# EAGLE design control (EAGLE 9.6.2)
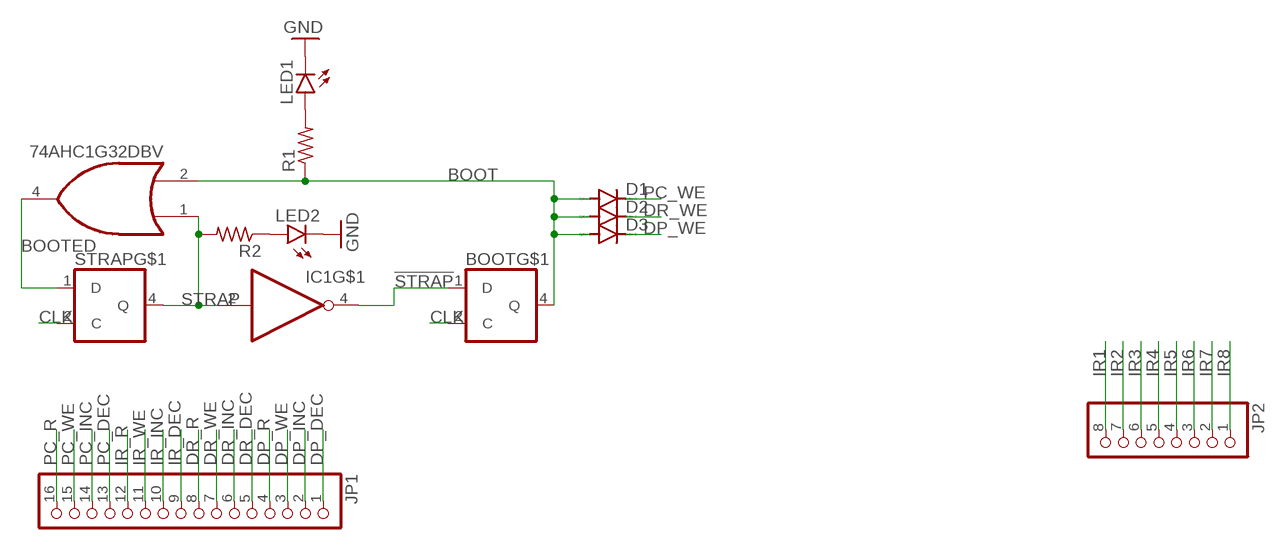
[diagram p0: schematic, sheet 1]

## Parts
BOOT  74LVC1G79DBV  [SOT23-5]
D1  DIODE-SOD323-W  [SOD323-W]
D2  DIODE-SOD323-W  [SOD323-W]
D3  DIODE-SOD323-W  [SOD323-W]
IC1  74AUC1G06DBV  [SOT23-5]
IC2  74AHC1G32DBV  [SOT23-5]
JP1  PINHD-1X16  [1X16]
JP2  PINHD-1X8  [1X08]
LED1  LEDCHIP-LED0603  [CHIP-LED0603]
LED2  LEDCHIP-LED0603  [CHIP-LED0603]
R1  R-US_R0603  [R0603]
R2  R-US_R0603  [R0603]
STRAP  74LVC1G79DBV  [SOT23-5]

## Nets
!STRAP: BOOT.1(D) IC1.4(O)
BOOT: BOOT.4(Q) D1.A D2.A D3.A IC2.2(I1) R1.1
BOOTED: IC2.4(O) STRAP.1(D)
CLK: BOOT.2(C) STRAP.2(C)
DP_DEC: JP1.1
DP_INC: JP1.2
DP_R: JP1.4
DP_WE: D3.C JP1.3
DR_DEC: JP1.5
DR_INC: JP1.6
DR_R: JP1.8
DR_WE: D2.C JP1.7
GND: LED1.C LED2.C
IR1: JP2.8
IR2: JP2.7
IR3: JP2.6
IR4: JP2.5
IR5: JP2.4
IR6: JP2.3
IR7: JP2.2
IR8: JP2.1
IR_DEC: JP1.9
IR_INC: JP1.10
IR_R: JP1.12
IR_WE: JP1.11
N$1: LED1.A R1.2
N$2: LED2.A R2.1
PC_DEC: JP1.13
PC_INC: JP1.14
PC_R: JP1.16
PC_WE: D1.C JP1.15
STRAP: IC1.2(I) IC2.1(I0) R2.2 STRAP.4(Q)

## Power pins joined to a net without a drawn wire
GND: BOOT.3(GND) IC1.3(GND) IC2.3(GND) STRAP.3(GND)
VCC: BOOT.5(VCC) IC1.5(VCC) IC2.5(VCC) STRAP.5(VCC)

## Library data of the parts
BOOT STRAP = 74xx-little-us:74*1G79: Single Positive-Edge-Triggered D-Type Flip-Flop Source: Data sheet <http://www.ti.com/lit/ds/symlink/sn74lvc1g79.pdf>
D1-D3 = diode:DIODE-: DIODE
IC1 = 74xx-little-us:74*1G06: Single Inverter Buffer/Driver With Open-Drain Output
IC2 = 74xx-little-us:74*1G32: 2-input OR gate
JP1 = pinhead:PINHD-1X16: PIN HEADER
JP2 = pinhead:PINHD-1X8: PIN HEADER
LED1 LED2 = led:LED: LED OSRAM: - CHIPLED LG R971, LG N971, LY N971, LG Q971, LY Q971, LO R971, LY R971 LH N974, LH R974 LS Q976, LO Q976, LY Q976 LO Q996 - Hyper CHIPLED LW Q18S LB Q993, LB Q99A, LB R99A - SideLED LS A670, LO A670, LY A670, LG A670, LP A670 LB A673, LV A673, LT A673, LW A673 LH A674 LY A675 LS A676, LA A676, LO A676, LY A676, LW A676 LS A679, LY A679, LG A679 - Hyper Micro SIDELED® LS Y876, LA Y876, LO Y876, LY Y876 LT Y87S - SmartLED LW L88C, LW L88S LB L89C, LB L89S, LG L890 LS L89K, LO L89K, LY L89K LS L896, LA L896, LO L896, LY L896 - TOPLED LS T670, LO T670, LY T670, LG T670, LP T670 LSG T670, LSP T670, LSY T670, LOP T670, LYG T670 LG T671, LOG T671, LSG T671 LB T673, LV T673, LT T673, LW T673 LH T674 LS T676, LA T676, LO T676, LY T676, LB T676, LH T676, LSB T676, LW T676 LB T67C, LV T67C, LT T67C, LS T67K, LO T67K, LY T67K, LW E67C LS E67B, LA E67B, LO E67B, LY E67B, LB E67C, LV E67C, LT E67C LW T67C LS T679, LY T679, LG T679 LS T770, LO T770, LY T770, LG T770, LP T770 LB T773, LV T773, LT T773, LW T773 LH T774 LS E675, LA E675, LY E675, LS T675 LS T776, LA T776, LO T776, LY T776, LB T776 LHGB T686 LT T68C, LB T68C - Hyper Mini TOPLED® LB M676 - Mini TOPLED Santana® LG M470 LS M47K, LO M47K, LY M47K Source: http://www.osram.convergy.de LUXEON: - LUMILED® LXK2-PW12-R00, LXK2-PW12-S00, LXK2-PW14-U00, LXK2-PW14-V00 LXK2-PM12-R00, LXK2-PM12-S00, LXK2-PM14-U00 LXK2-PE12-Q00, LXK2-PE12-R00, LXK2-PE12-S00, LXK2-PE14-T00, LXK2-PE14-U00 LXK2-PB12-K00, LXK2-PB12-L00, LXK2-PB12-M00, LXK2-PB14-N00, LXK2-PB14-P00, LXK2-PB14-Q00 LXK2-PR12-L00, LXK2-PR12-M00, LXK2-PR14-Q00, LXK2-PR14-R00 LXK2-PD12-Q00, LXK2-PD12-R00, LXK2-PD12-S00 LXK2-PH12-R00, LXK2-PH12-S00 LXK2-PL12-P00, LXK2-PL12-Q00, LXK2-PL12-R00 Source: www.luxeon.com KINGBRIGHT: KA-3528ASYC Source: www.kingbright.com
R1 R2 = rcl:R-US_: RESISTOR, American symbol; SPICEPREFIX: R

## Board
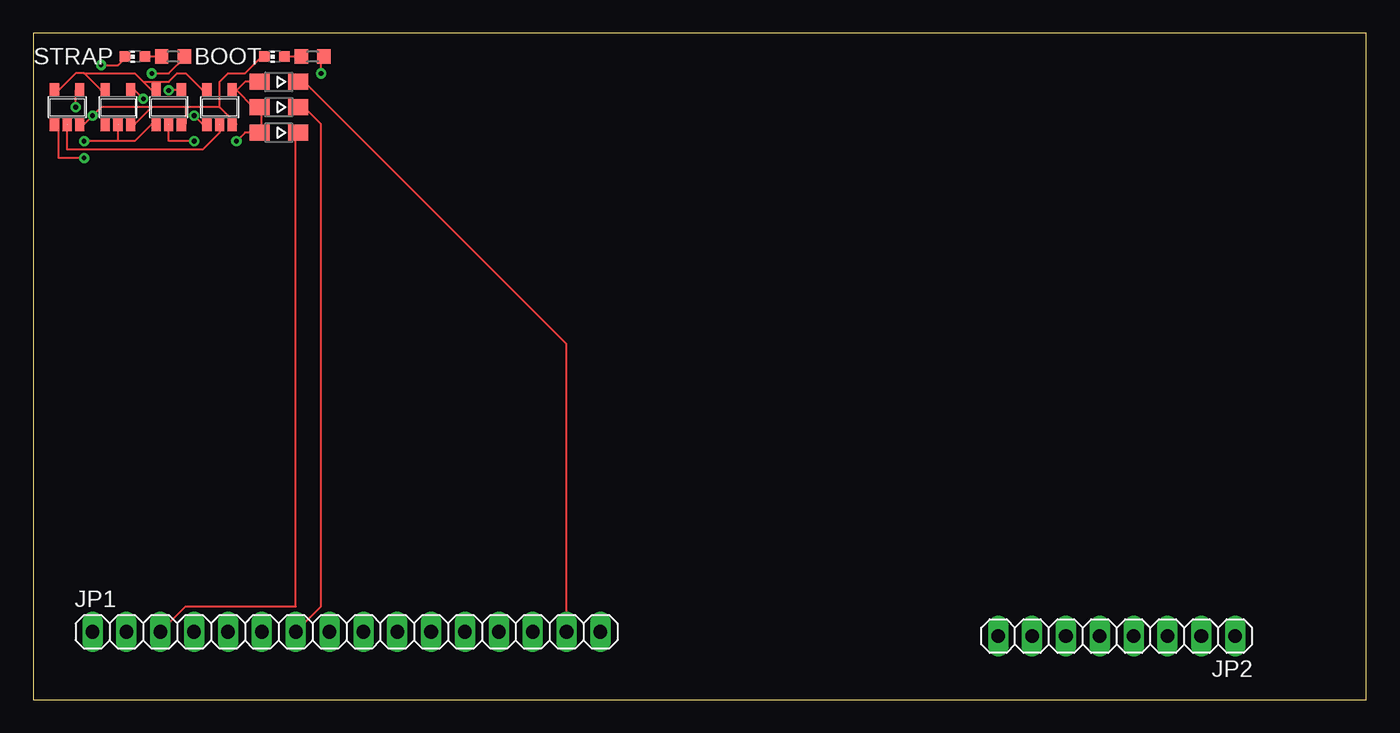
[diagram p1: board, top side]
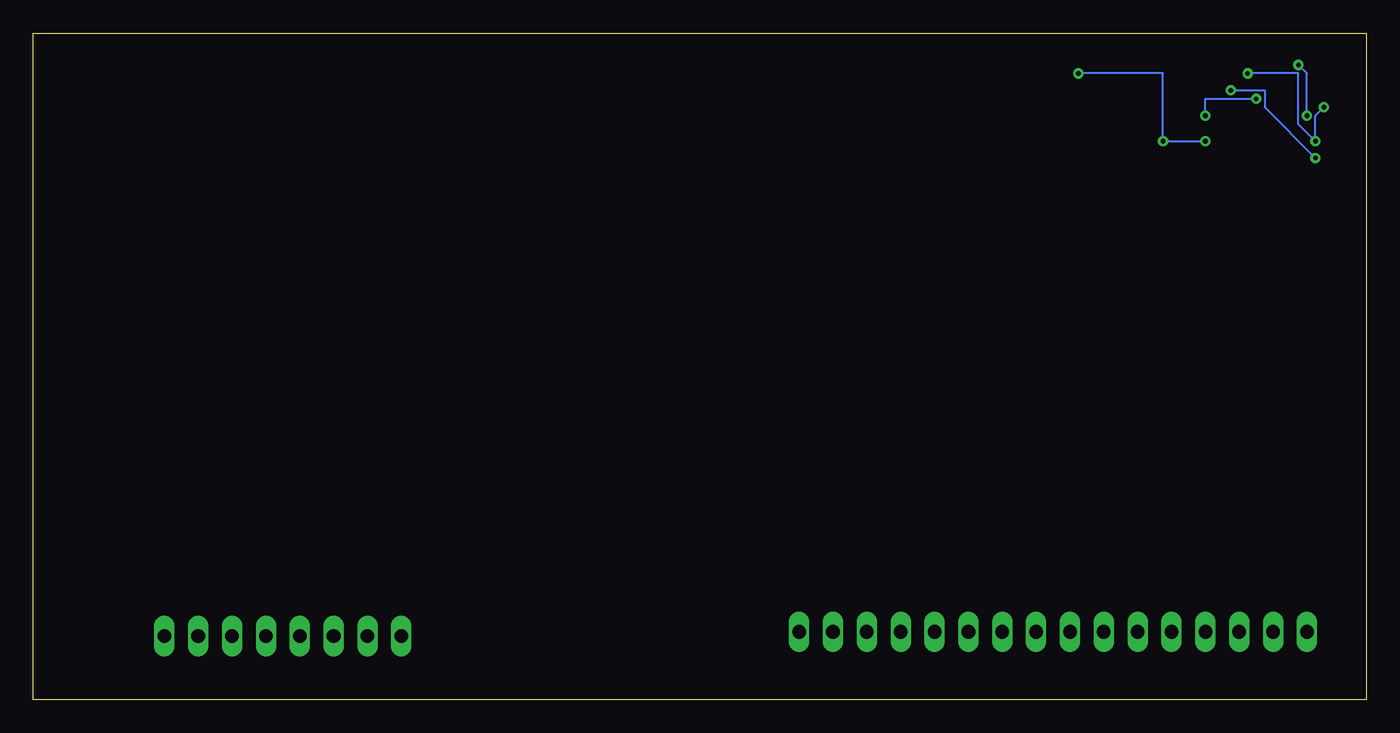
[diagram p2: board, bottom side, seen from below]

Size 100 x 50 mm. Coordinates in mm from the lower left corner, seen from the top.
Outline: 0,0 100,0 100,50 0,50 0,0
Copper layers (1*16): Top 0.035mm / dielectric 1.5mm / Bottom 0.035mm
Design rules "default": minimum track width 6mil, minimum drill 0.35mm, track to track 6mil, track to pad 6mil, pad to pad 6mil, via to via 6mil, smd to smd 6mil, copper to edge 40mil, drill to drill 6mil, minimum pad ring 10mil, minimum via ring 8mil, stop-mask expansion 4mil, vias tented up to drill 0mil, thermal gap 10mil

### Footprints (pad centres in the part's own frame; a part is rotated, then mirrored left to right if it is on the bottom)
SOT23-5 = smd 0.69 x 0.99: 1 -0.95,-1.29; 2 0,-1.29; 3 0.95,-1.29; 4 0.95,1.3; 5 -0.95,1.3
SOD323-W = smd 1.5 x 1.2: A 1.45,0; C -1.45,0
1X16 = drill 1.016 long: 1 -19.05,0; 2 -16.51,0; 3 -13.97,0; 4 -11.43,0; 5 -8.89,0; 6 -6.35,0; 7 -3.81,0; 8 -1.27,0; 9 1.27,0; 10 3.81,0; 11 6.35,0; 12 8.89,0; 13 11.43,0; 14 13.97,0; 15 16.51,0; 16 19.05,0
1X08 = drill 1.016 long: 1 -8.89,0; 2 -6.35,0; 3 -3.81,0; 4 -1.27,0; 5 1.27,0; 6 3.81,0; 7 6.35,0; 8 8.89,0
CHIP-LED0603 = smd 0.8 x 0.8: A 0,-0.75; C 0,0.75
R0603 = smd 1 x 1.1: 1 -0.85,0; 2 0.85,0

### Placement (x,y rotation side)
BOOT  13.97,44.45 0 top
D1  18.41,46.35 180 top
D2  18.41,44.45 180 top
D3  18.41,42.55 180 top
IC1  6.35,44.45 0 top
IC2  10.16,44.45 0 top
JP1  23.5,5.08 0 top
JP2  81.28,4.76 180 top
LED1  18.1,48.26 90 top
LED2  7.62,48.26 90 top
R1  20.95,48.26 180 top
R2  10.48,48.26 0 top
STRAP  2.54,44.45 0 top

### Tracks (layer width: path | path; a pad name or v marks a point on that pad's centre or on a via)
!STRAP  (via drill 0.35)
  Top 0.152: v8.26,45.09 7.62,45.72 IC1.4 | v12.06,43.81 12.7,43.18 BOOT.1
  Bottom 0.152: v8.26,45.09 12.06,45.09 v12.06,43.81
BOOT  (via drill 0.35)
  Top 0.152: 15.24,45.72 15.88,46.35 D1.A | 15.24,45.72 16.51,44.45 D2.A 17.14,44.45 17.14,42.55 D3.A 15.88,42.55 v15.24,41.91 | 15.24,45.72 BOOT.4 | v12.06,41.91 10.16,41.91 IC2.2 10.16,43.18 | v21.59,46.99 21.59,48.26 R1.1
  Bottom 0.152: v12.06,41.91 v15.24,41.91 15.24,46.99 v21.59,46.99
BOOTED  (via drill 0.35)
  Top 0.152: v3.81,40.64 1.91,40.64 1.91,43.18 STRAP.1 | v10.16,45.72 10.79,45.72 IC2.4
  Bottom 0.152: v3.81,40.64 7.62,44.45 7.62,45.72 v10.16,45.72
CLK
  Top 0.152: 2.54,43.18 STRAP.2 2.54,41.27 12.7,41.27 13.97,42.55 BOOT.2 13.97,43.18
DP_WE
  Top 0.152: JP1.3 11.43,6.99 19.68,6.99 19.68,42.55 D3.C
DR_WE
  Top 0.152: JP1.7 21.59,6.99 21.59,43.18 20.32,44.45 D2.C
GND  (via drill 0.35)
  Top 0.152: v5.08,47.62 6.35,47.62 6.99,48.26 LED2.C | STRAP.3 3.81,43.18 v4.45,43.81 5.08,44.45 8.89,44.45 | 13.97,44.45 13.97,46.35 14.61,46.99 15.88,46.99 17.14,48.26 LED1.C | 13.97,44.45 15.24,43.18 BOOT.3 | 8.89,44.45 7.62,43.18 IC1.3 | 13.97,44.45 11.43,44.45 | 11.43,44.45 8.89,44.45 | 11.43,44.45 11.43,43.18 IC2.3
  Bottom 0.152: v5.08,47.62 4.45,46.99 v4.45,43.81
N$1
  Top 0.152: R1.2 LED1.A
N$2
  Top 0.152: R2.1 LED2.A 8.26,48.26
PC_WE
  Top 0.152: JP1.15 40.01,26.67 20.32,46.35 D1.C
STRAP  (via drill 0.35)
  Top 0.152: 6.35,41.91 IC1.2 6.35,43.18 | 6.35,41.91 7.62,41.91 8.89,43.18 IC2.1 | v3.17,44.45 3.17,45.72 STRAP.4 | 6.35,41.91 v3.81,41.91 | v8.89,46.99 10.16,46.99 11.43,48.26 R2.2
  Bottom 0.152: v3.17,44.45 3.81,43.81 v3.81,41.91 5.08,43.18 5.08,46.99 v8.89,46.99
VCC
  Top 0.152: 3.81,46.99 3.17,46.99 1.91,45.72 STRAP.5 | 3.81,46.99 5.08,45.72 IC1.5 | 8.26,46.35 7.62,46.99 3.81,46.99 | 8.26,46.35 8.89,45.72 IC2.5 | 8.26,46.35 10.16,46.35 10.79,46.99 11.43,46.99 12.7,45.72 BOOT.5